# EasyEDA Pro project ProProject_aDataFlow_v2_pub_2024-01-13.epro, board PCB7
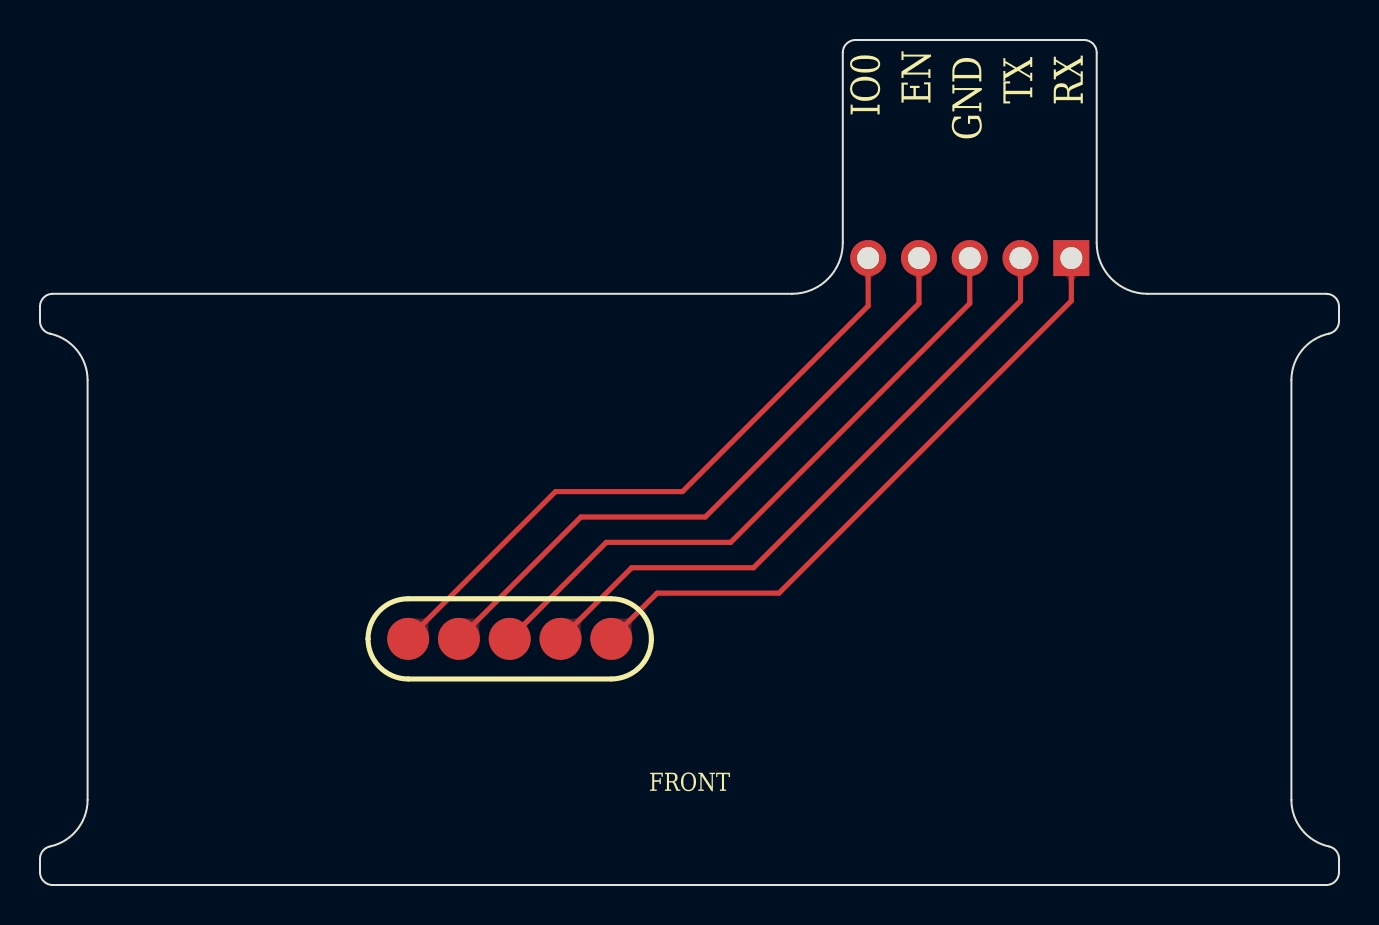
[diagram p7: board, top side]
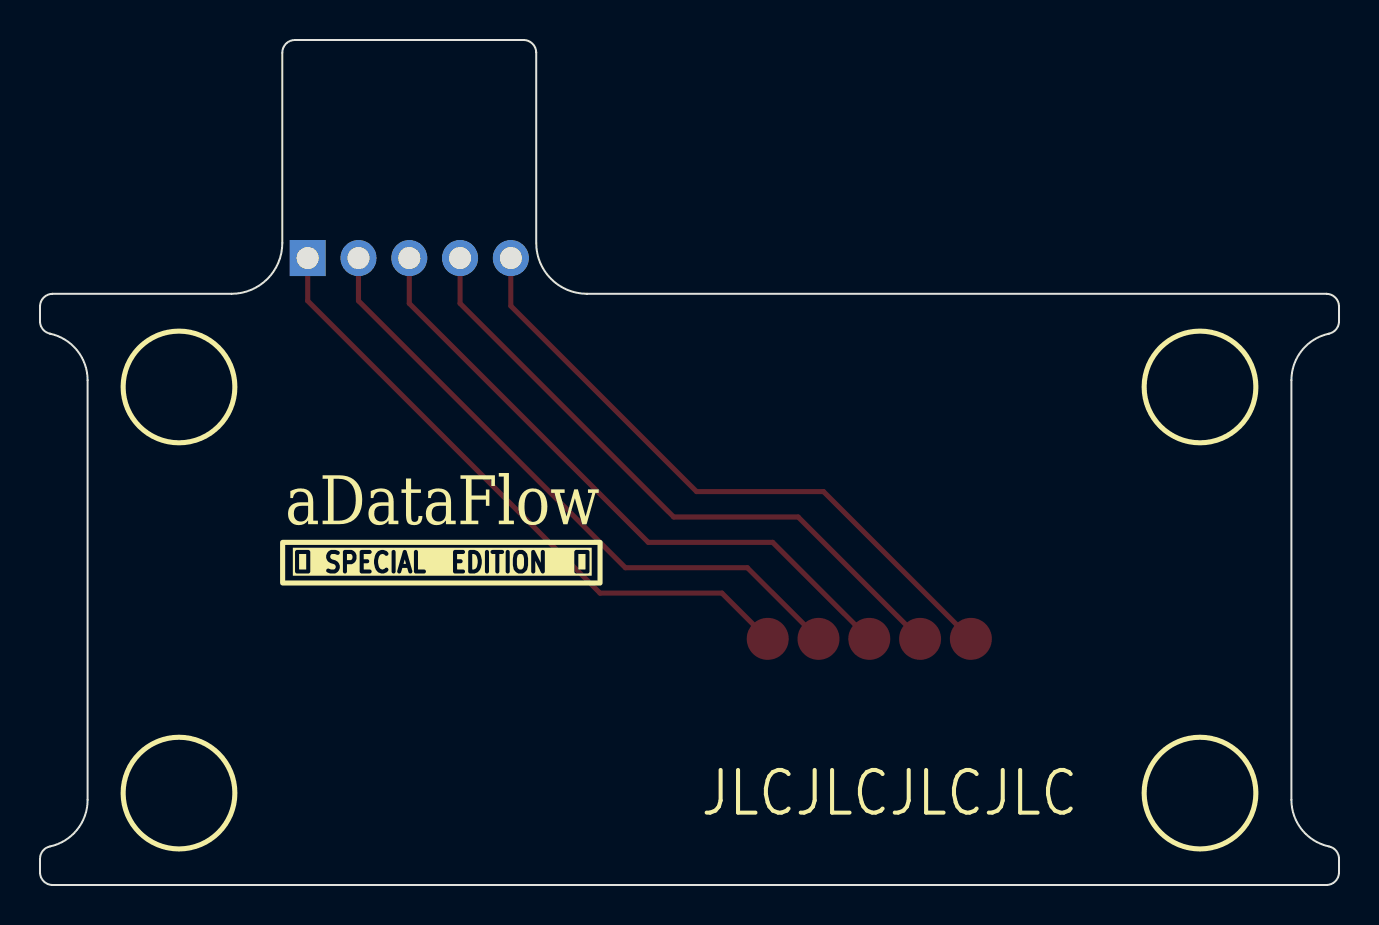
[diagram p8: board, bottom side, seen from below]

Outline 64.97 x 42.28 mm; copper layers: Top Layer, Bottom Layer. Coordinates in mm from the lower left corner of the outline.
Outline path: 0,28.95 0,28.21 arc(0.14,27.81) 0.5,27.59 arc(1.85,26.75) 2.38,25.26 2.38,4.26 arc(1.85,2.76) 0.5,1.93 arc(0.14,1.71) 0,1.31 0,0.63 arc(0.19,0.19) 0.63,0 64.33,0 arc(64.78,0.19) 64.97,0.63 64.97,1.31 arc(64.83,1.71) 64.47,1.93 arc(63.12,2.76) 62.59,4.26 62.59,25.26 arc(63.12,26.75) 64.47,27.59 arc(64.83,27.81) 64.97,28.21 64.97,28.95 arc(64.78,29.39) 64.33,29.58 55.39,29.58 arc(53.59,30.32) 52.85,32.12 52.85,41.65 arc(52.66,42.09) 52.21,42.28 40.79,42.28 arc(40.34,42.09) 40.15,41.65 40.15,32.12 arc(39.41,30.32) 37.61,29.58 0.63,29.58 arc(0.19,29.39) 0,28.95
Stack: Top Layer 0.035mm / Dielectric1 1.51mm FR4 er 4.5 / Bottom Layer 0.035mm

## Design rules (mm)
template: JLCPCB Capability(Two Layers Board)
spacing copperThickness1oz (default): track to track 0.102, other pairs 0.152 to 0.3
spacing copperThickness2oz: track to track 0.203, other pairs 0.152 to 0.3
track width copperThickness1oz (default): min 0.127, default 0.254, max 2.54
track width copperThickness2oz: min 0.203, default 0.254, max 2.54
differential pair differentialPair (default): width min 0.127, default 0.254, max 2.54; gap min 0.152, default 0.152
via viaSize (default): diameter min 0.5, default 0.61, max 10; hole min 0.3, default 0.305, max 6.3

## Placement (name value [footprint] x y rotation side)
CN1  YTC1P-2510-01  [SMD-1_BD2.0-H10.0]  28.57 12.32 180 top
CN2  YTC1P-2510-01  [SMD-1_BD2.0-H10.0]  26.03 12.32 180 top
CN3  YTC1P-2510-01  [SMD-1_BD2.0-H10.0]  23.49 12.32 180 top
CN4  YTC1P-2510-01  [SMD-1_BD2.0-H10.0]  20.95 12.32 180 top
CN5  YTC1P-2510-01  [smd-1_bd2.0-h10.0]  18.41 12.32 180 top
H1  PZ254R-11-05P  [HDR-TH_5P-P2.54-H-M-W10.4]  46.5 31.37 180 top

## Footprints (pads in the part's own frame, mm; a bottom-side part is the same pattern mirrored in y, then rotated)
HDR-TH_5P-P2.54-H-M-W10.4
  rect 1.8x1.8 hole 1.1: 1(-5.08,0)
  round 1.8 hole 1.1: 2(-2.54,0) 3(0,0) 4(2.54,0) 5(5.08,0)
SMD-1_BD2.0-H10.0
  round 2.1 smd: 1(0,0)
smd-1_bd2.0-h10.0
  round 2.1 smd: 1(0,0)

## Nets
As in the schematic.

## Routing (per net, layer and track width the routed paths; a pad name or vN(x,y) marks a point on that pad's centre or on a via; arc(x,y) is an arc through that point)
GND: length 32.2
  Top Layer w0.254: CN3.1 28.32,17.14 34.54,17.14 46.5,29.1 H1.3
$1N347: length 32.2
  Top Layer w0.254: CN1.1 30.86,14.6 36.96,14.6 51.58,29.23 H1.1 51.56,31.35
$1N350: length 32.2
  Top Layer w0.254: CN2.1 29.59,15.87 35.69,15.87 49.04,29.23 H1.2 49.02,31.35
$1N360: length 32.3
  Top Layer w0.254: CN4.1 27.05,18.41 33.27,18.41 43.96,29.1 H1.4 43.94,31.35
$1N365: length 32.3
  Top Layer w0.254: 41.4,31.35 H1.5 41.42,28.97 32.13,19.68 25.78,19.68 CN5.1

## Copper pours and planes (outline as drawn; the poured copper is in the pictures)
GND on Top Layer: -6.48,47.88 74.3,47.88 74.3,-9.02 -6.48,-9.02
GND on Bottom Layer: -7.37,50.16 75.82,50.16 75.82,-8.89 -7.37,-8.89

Small or netless copper shapes (teardrops, artwork), in the pictures only: 8 on Top Layer

## Text on the board
Bottom Silkscreen Layer: JLCJLCJLCJLC | ⭐️ SPECIAL  EDITION  ⭐️ | aDataFlow
Top Silkscreen Layer: FRONT | IO0 | EN | GND | TX | RX
